# Altium project ESPGatewayProject.PrjPCB
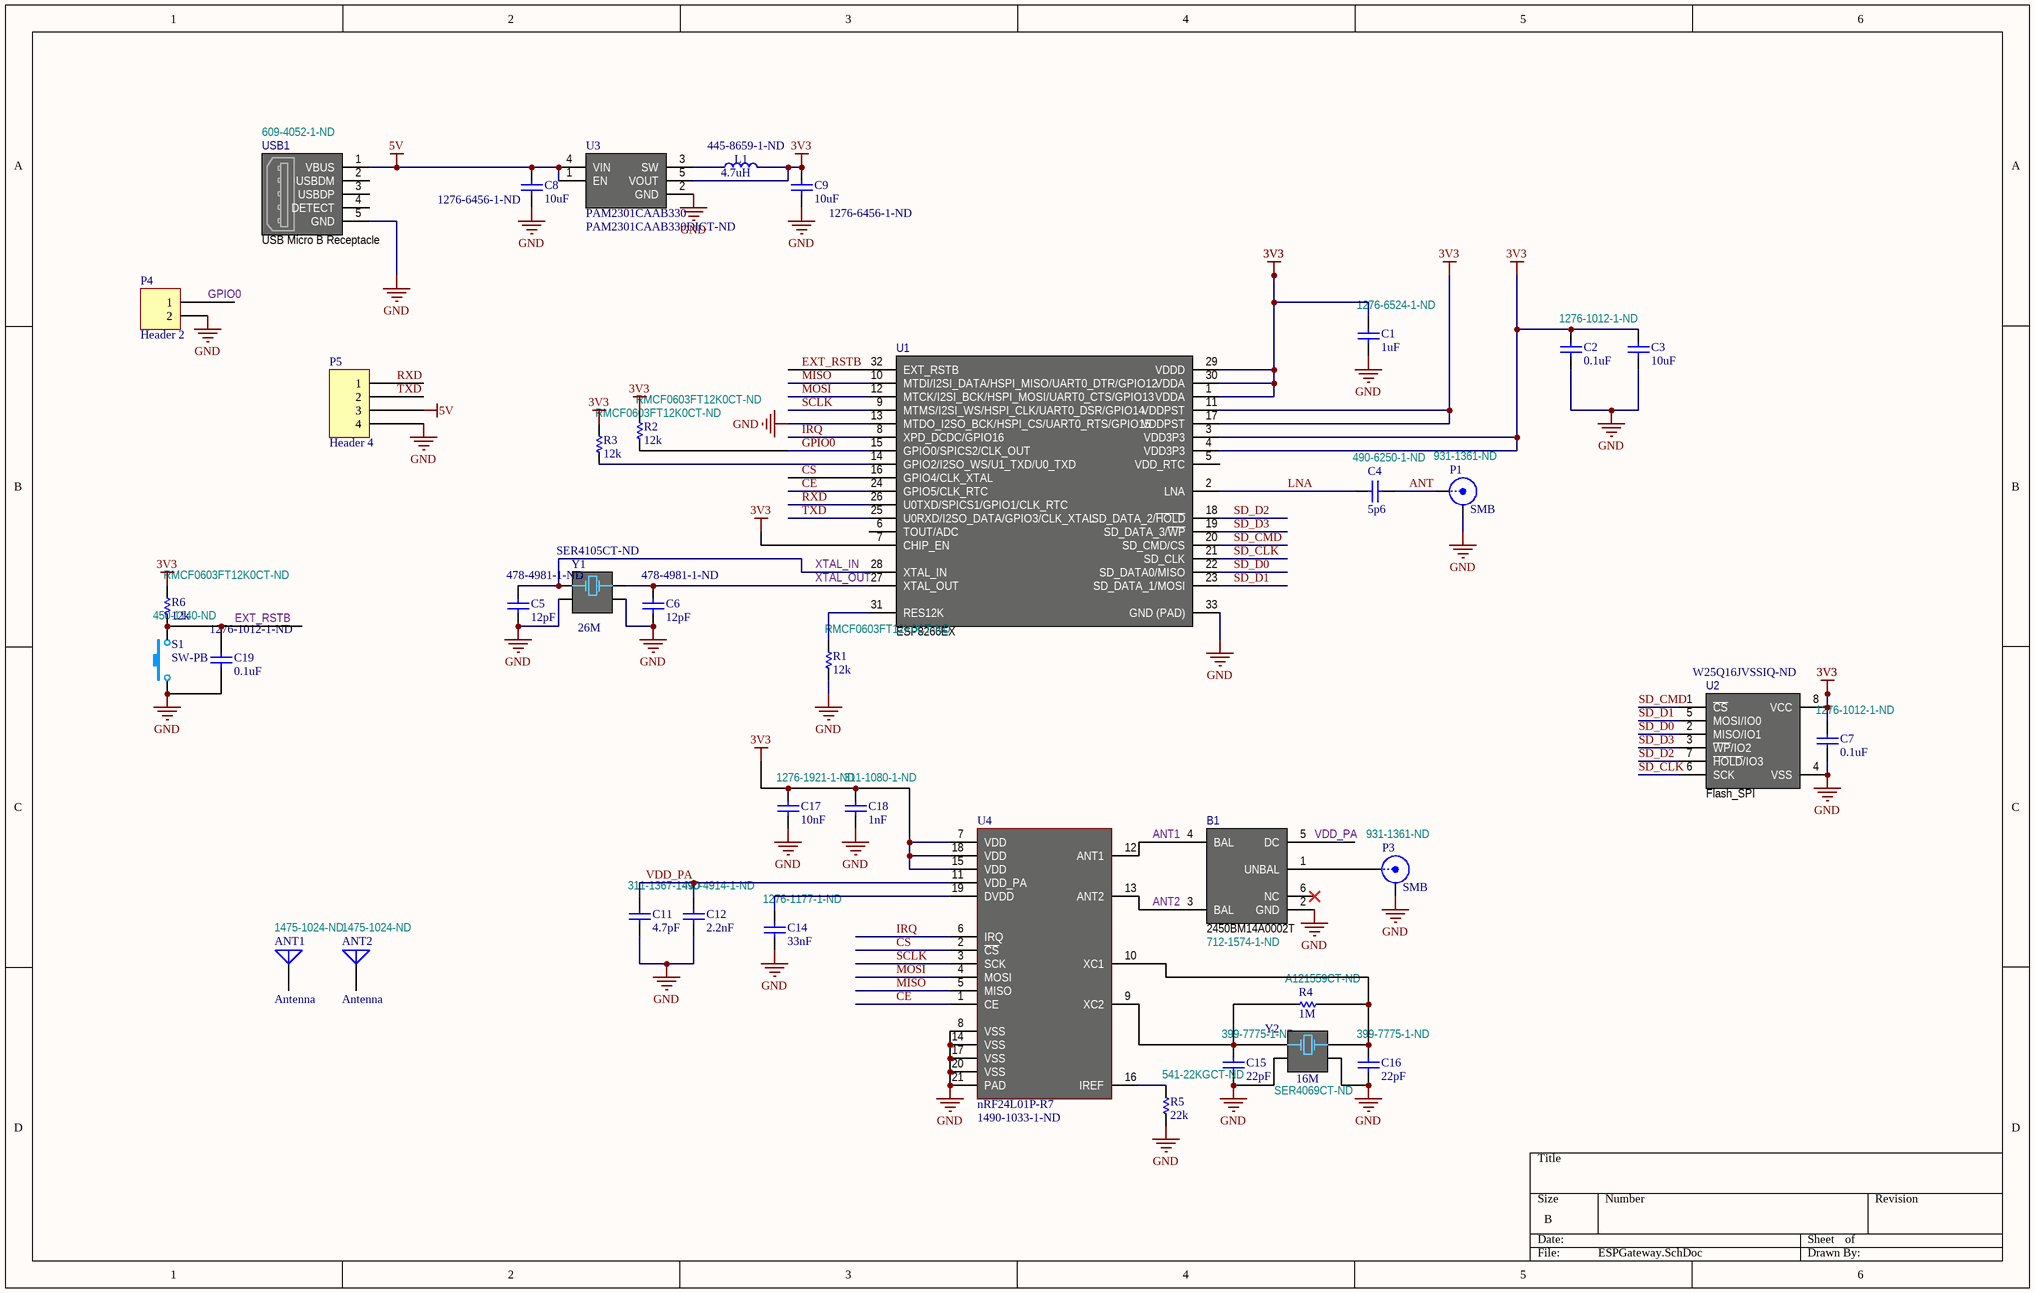
[diagram p0: ESPGateway.SchDoc]
1 sheet, 39 parts. Net scope: global (net labels, ports and power ports of the same name join across sheets).
Board file: ESPGateway.PcbDoc

## Sheet ESPGateway.SchDoc
size B

### Parts
ANT1  Antenna  Supplier Part Number 1: 1475-1024-ND  [PIN1]  (mechanical)
ANT2  Antenna  Supplier Part Number 1: 1475-1024-ND  [PIN1]  (mechanical)
B1  2450BM14A0002T  Supplier Part Number 1: 712-1574-1-ND  [2450BM15A0002E]
C1  1uF  Supplier Part Number 1: 1276-6524-1-ND  [CAPC1608N]
C2  0.1uF  Supplier Part Number 2: 1276-1012-1-ND  [CAPC1608N]
C3  10uF  [CAPC1608N]
C4  5p6  Supplier Part Number 1: 490-6250-1-ND  [CAPC1005N]
C5  12pF  Supplier Part Number 1: 478-4981-1-ND  [CAPC1608N]
C6  12pF  Supplier Part Number 1: 478-4981-1-ND  [CAPC1608N]
C7  0.1uF  Supplier Part Number 1: 1276-1012-1-ND  [CAPC1608N]
C8  10uF  Supplier Part Number 1: 1276-6456-1-ND  [CAPC2012N]
C9  10uF  Supplier Part Number 1: 1276-6456-1-ND  [CAPC2012N]
C11  4.7pF  Supplier Part Number 1: 311-1367-1-ND  [CAPC1005N]
C12  2.2nF  Supplier Part Number 1: 490-4914-1-ND  [CAPC1005N]
C14  33nF  Supplier Part Number 2: 1276-1177-1-ND  [CAPC1005N]
C15  22pF  Supplier Part Number 1: 399-7775-1-ND  [CAPC1005N]
C16  22pF  Supplier Part Number 1: 399-7775-1-ND  [CAPC1005N]
C17  10nF  Supplier Part Number 1: 1276-1921-1-ND  [CAPC1608N]
C18  1nF  Supplier Part Number 1: 311-1080-1-ND  [CAPC1608N]
C19  0.1uF  Supplier Part Number 1: 1276-1012-1-ND  [CAPC1608N]
L1  value 4.7uH  Supplier Part Number 1: 445-8659-1-ND  [INDC2012N]  (hidden comment: Inductor)
P1  SMB  Supplier Part Number 1: 931-1361-ND  [SMA-J-P-X-RA-TH1]
P3  SMB  Supplier Part Number 1: 931-1361-ND  [SMA-J-P-X-RA-TH1]
P4  Header 2  [HDR1X2]
P5  Header 4  [HDR1X4]
R1  12k  Supplier Part Number 2: RMCF0603FT12K0CT-ND  [RESC1608N]
R2  12k  Supplier Part Number 2: RMCF0603FT12K0CT-ND  [RESC1608N]
R3  12k  Supplier Part Number 2: RMCF0603FT12K0CT-ND  [RESC1608N]
R4  1M  Supplier Part Number 2: A121559CT-ND  [RESC1005N]
R5  22k  Supplier Part Number 2: 541-22KGCT-ND  [RESC1005N]
R6  12k  Supplier Part Number 3: RMCF0603FT12K0CT-ND  [RESC1608N]
S1  SW-PB  Supplier Part Number 1: 450-1140-ND  [FSMSM]
U1  ESP8266EX  [QFN50P500X500-32V2N]
U2  Flash_SPI  Supplier Part Number 1: W25Q16JVSSIQ-ND  [SOIC127P1030-8N]
U3  PAM2301CAAB330  Supplier Part Number 1: PAM2301CAAB330DICT-ND  [SOT23-5AN]
U4  nRF24L01P-R7  Supplier Part Number 1: 1490-1033-1-ND  [QFN50P400X400-20VN]
USB1  USB Micro B Receptacle  Supplier Part Number 1: 609-4052-1-ND  [10104110-0001LF]
Y1  26M  Supplier Part Number 1: SER4105CT-ND  [XTAL2520-4]
Y2  16M  Supplier Part Number 1: SER4069CT-ND  [XTAL3225-4-N]

### Nets
3V3: C1.2 C2.2 C3.2 C7.2 C9.2 C17.2 C18.2 L1.2 R2.1 R3.1 R6.1 U1.1(VDDA) U1.3(VDD3P3) U1.4(VDD3P3) U1.7(CHIP_EN) U1.11(VDDPST) U1.17(VDDPST) U1.29(VDDD) U1.30(VDDA) U2.8(VCC) U3.5(VOUT) U4.7(VDD) U4.15(VDD) U4.18(VDD)
5V: C8.2 P5.3 U3.1(EN) U3.4(VIN) USB1.1(VBUS)
GND: B1.2(GND) C1.1 C2.1 C3.1 C5.1 C6.1 C7.1 C8.1 C9.1 C11.1 C12.1 C14.1 C15.1 C16.1 C17.1 C18.1 C19.1 P1.2(Y) P3.2(Y) P4.2 P5.4 R1.1 R5.1 S1.1 U1.13(MTDO_I2SO_BCK/HSPI_CS/UART0_RTS/GPIO15) U1.33(GND_(PAD)) U2.4(VSS) U3.2(GND) U4.8(VSS) U4.14(VSS) U4.17(VSS) U4.20(VSS) U4.21(PAD) USB1.5(GND) Y1.2 Y1.4 Y2.2 Y2.4
ANT: C4.1 P1.1(X)
ANT1: B1.4(BAL) U4.12(ANT1)
ANT2: B1.3(BAL) U4.13(ANT2)
CE: U1.24(GPIO5/CLK_RTC) U4.1(CE)
CS: U1.16(GPIO4/CLK_XTAL) U4.2(~{CS})
EXT_RSTB: C19.2 R6.2 S1.2 U1.32(EXT_RSTB)
GPIO0: P4.1 R2.2 U1.15(GPIO0/SPICS2/CLK_OUT)
IRQ: U1.8(XPD_DCDC/GPIO16) U4.6(IRQ)
LNA: C4.2 U1.2(LNA)
MISO: U1.10(MTDI/I2SI_DATA/HSPI_MISO/UART0_DTR/GPIO12) U4.5(MISO)
MOSI: U1.12(MTCK/I2SI_BCK/HSPI_MOSI/UART0_CTS/GPIO13) U4.4(MOSI)
RXD: P5.1 U1.26(U0TXD/SPICS1/GPIO1/CLK_RTC)
SCLK: U1.9(MTMS/I2SI_WS/HSPI_CLK/UART0_DSR/GPIO14) U4.3(SCK)
SD_CLK: U1.21(SD_CLK) U2.6(SCK)
SD_CMD: U1.20(SD_CMD/CS) U2.1(~{CS})
SD_D0: U1.22(SD_DATA0/MISO) U2.2(MISO/IO1)
SD_D1: U1.23(SD_DATA_1/MOSI) U2.5(MOSI/IO0)
SD_D2: U1.18(SD_DATA_2/~{HOLD}) U2.7(~{HOLD}/IO3)
SD_D3: U1.19(SD_DATA_3/~{WP}) U2.3(~{WP}/IO2)
TXD: P5.2 U1.25(U0RXD/I2SO_DATA/GPIO3/CLK_XTAL)
VDD_PA: B1.5(DC) C11.2 C12.2 U4.11(VDD_PA)
XTAL_IN: C5.2 U1.28(XTAL_IN) Y1.1(OSC1)
XTAL_OUT: C6.2 U1.27(XTAL_OUT) Y1.3(OSC2)
NetB1_1: B1.1(UNBAL) P3.1(X)
NetC14_2: C14.2 U4.19(DVDD)
NetC15_2: C15.2 R4.2 U4.9(XC2) Y2.1(OSC1)
NetC16_2: C16.2 R4.1 U4.10(XC1) Y2.3(OSC2)
NetL1_1: L1.1 U3.3(SW)
NetR1_2: R1.2 U1.31(RES12K)
NetR3_2: R3.2 U1.14(GPIO2/I2SO_WS/U1_TXD/U0_TXD)
NetR5_2: R5.2 U4.16(IREF)

Not connected (* = marked no-connect by the designer): ANT1 1(A); ANT2 1(A); B1 6(NC)*; U1 5(VDD_RTC) 6(TOUT/ADC); USB1 2(USBDM) 3(USBDP) 4(DETECT)

### Library data of the parts
ANT1 ANT2 = Antenna: Generic Antenna; Published: 24-Mar-1999; LatestRevisionDate: 17-Jul-2002; LatestRevisionNote: Re-released for DXP Platform.; PackageReference: PIN1; Publisher: Altium Limited; Supplier 1: Digi-Key
B1 = 2450BM14A0002T: JOHANSON TECHNOLOGY         2450BM14A0002T             Baluns Transformer, SMD, 2.4 GHz, 2.5 GHz, 2 dB, 0603; Impedance: 50R; Frequency: 2.45GHz; Insertion Loss: 2dB; Max Frequency: 2.5GHz; Return Loss: 9.5dB; Supplier 1: Digi-Key; Manufacturer: Johanson; Manufacturer Part Number: 2450BM14A0002T; Stock 1: 209106; Pricing 1: 1=0.94, 10=0.83, 25=0.7496, 100=0.656, 250=0.57568, 500=0.50872, 1000=0.40163 (USD); Mount: Surface Mount; Case/Package: 0603; Number of Pins: 6; Case Code (Metric): 1608; Case Code (Imperial): 0603; Contact Plating: Matte,Tin; Min Operating Temperature: -40°C; Max Operating Temperature: 85°C; Package Quantity: 4000; Packaging: Tape and Reel; Termination: SMD/SMT; REACH SVHC: Unknown; ComponentLink1URL: http://www.farnell.com/datasheets/1643106.pdf; ComponentLink1Description: http://www.farnell.com/datasheets/1643106.pdf; ComponentLink2URL: https://www.johansontechnology.com/datasheets/baluns/Balun_Filter_Matched_2450BM14A0002_v2.pdf; ComponentLink2Description: https://www.johansontechnology.com/datasheets/baluns/Balun_Filter_Matched_2450BM14A0002_v2.pdf; ComponentLink3URL: http://www.mouser.com/ds/2/611/2450BM14A0002T-247800.pdf; ComponentLink3Description: http://www.mouser.com/ds/2/611/2450BM14A0002T-247800.pdf
C1-C9 C11 C12 C14-C19 = Cap Semi: Capacitor (Semiconductor SIM Model); Published: 8-Jun-2000; LatestRevisionDate: 29-May-2009; LatestRevisionNote: IPC-7351 Footprint Added.; PackageReference: C1206; Publisher: Altium Limited; PackageDescription: Chip Capacitor
  C1 C4-C9 C11 C12 C15-C19: Supplier 1: Digi-Key
  C2 C14: Supplier 1: Digi-Key; Supplier 2: Digi-Key
L1 = Inductor: Code_IEC: 1005; Published: 8-Jun-2000; LatestRevisionDate: 29-May-2009; LatestRevisionNote: IPC-7351 Footprint Added.; PackageReference: 0402-A; Publisher: Altium Limited; PackageDescription: Chip Inductor; Code_JEITA: 0402; Supplier 1: Digi-Key
P1 P3 = SMB: SMB Straight Connector; LatestRevisionDate: 17-Jul-2002; LatestRevisionNote: Re-released for DXP Platform.; Publisher: Altium Limited; Supplier 1: Digi-Key
P4 = Header 2: Header, 2-Pin; LatestRevisionDate: 17-Jul-2002; LatestRevisionNote: Re-released for DXP Platform.; Publisher: Altium Limited
P5 = Header 4: Header, 4-Pin; LatestRevisionDate: 17-Jul-2002; LatestRevisionNote: Re-released for DXP Platform.; Publisher: Altium Limited
R1-R6 = Res Semi: Semiconductor Resistor; Published: 8-Jun-2000; LatestRevisionDate: 17-Jul-2002; LatestRevisionNote: Re-released for DXP Platform.; PackageReference: AXIAL-0.5; Publisher: Altium Limited; PackageDescription: Axial Device, Thru-Hole; 2 Leads; 0.5 in Pin Spacing; Supplier 1: Digi-Key; Supplier 2: Digi-Key
  R6: Supplier 3: Digi-Key
S1 = SW-PB: Switch; Published: 24-Mar-1999; LatestRevisionDate: 17-Jul-2002; LatestRevisionNote: Re-released for DXP Platform.; PackageReference: SPST-2; Publisher: Altium Limited; PackageDescription: Switch; 2 Leads; Supplier 1: Digi-Key
U3 = PAM2301CAAB330: IC REG BCK SYNC 3.3V 0.8A TSOT25; Manufacturer: Diodes; Number of Outputs: 1; Max Output Current: 800mA; Min Input Voltage: 2.5V; Max Input Voltage: 5.5V; Efficiency: 96%; Switching Frequency: 1.5MHz; Synchronous Rectifier: Yes; Output Type: Fixed; Output Configuration: Positive; Supplier 1: Digi-Key; Manufacturer Part Number: PAM2301CAAB330; Stock 1: 2099; Pricing 1: 1=0.6, 10=0.51, 100=0.3807, 500=0.29912, 1000=0.23113 (USD); Mount: Surface Mount; Case/Package: SOT-23-5; Number of Pins: 5; Min Operating Temperature: -40°C; Max Operating Temperature: 85°C; Package Quantity: 3000; Packaging: Tape and Reel; Output Voltage: 3.3V; Min Output Voltage: 3.3V; Output Current: 800mA; Operating Supply Voltage: 5.5V; Radiation Hardening: No
U4 = nRF24L01P-R7: RF Transceiver SNGL-CHP ULTR-LW POW 2.4GHz TRNSCVR; Manufacturer: Nordic Semiconductor; Interface: SPI; Data Rate: 2Mbps; Max Supply Voltage: 3.6V; Sensitivity: -94dBm; Current - Receiving: 13.5mA; Current - Transmitting: 11.3mA; Supplier 1: Digi-Key; Manufacturer Part Number: nRF24L01P-R7; Stock 1: 26627; Pricing 1: 1=3.53, 10=3.15, 25=2.8352, 100=2.583, 250=2.331, 500=2.0916 (USD); Case/Package: QFN; Min Operating Temperature: -40°C; Max Operating Temperature: 85°C; Packaging: Tape and Reel; Package Quantity: 1500; Frequency: 2.4GHz; Length: 4mm; Depth: 4mm
Y1 Y2 = XTAL_4SMD: Crystal Oscillator (4 pin); Published: 8-Jun-2000; LatestRevisionDate: 17-Jul-2002; LatestRevisionNote: Re-released for DXP Platform.; PackageReference: R38; Publisher: Altium Limited; PackageDescription: Crystal, Thru-Hole; 2 Leads; Body 3.1 x 8.2 mm (Dia.xH); Supplier 1: Digi-Key
U2 = Flash_SPI: Supplier 1: Digi-Key
USB1 = USB Micro B Receptacle: Supplier 1: Digi-Key